# Altium project TicketBot.PrjPcb
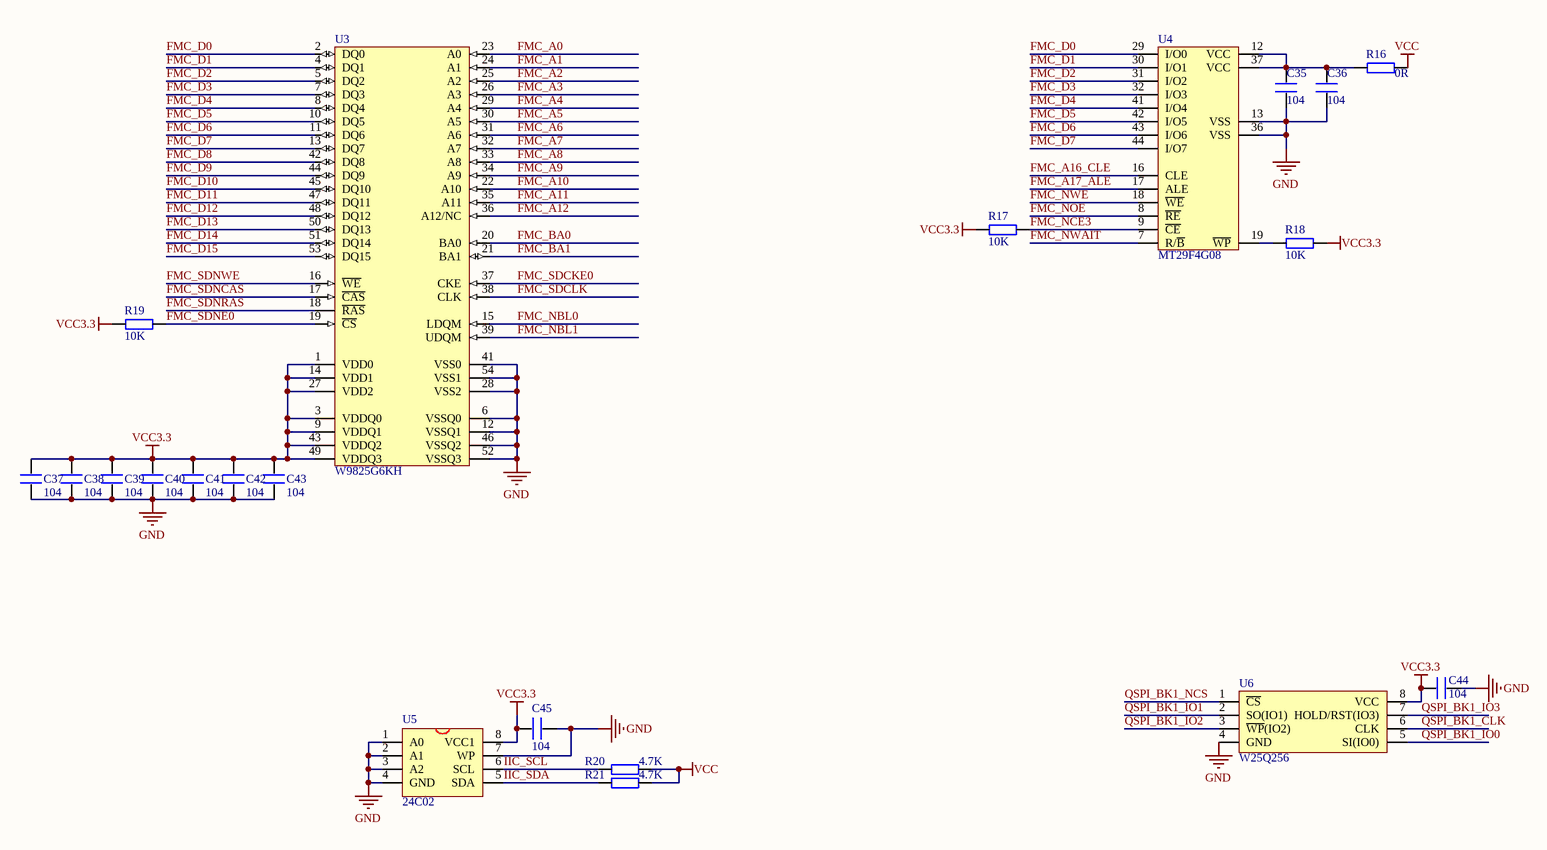
[diagram p0: mem.SchDoc]
2 sheets, 65 parts. Net scope: global (net labels, ports and power ports of the same name join across sheets).
Board files: corePCB1.PcbDoc, corePCB1nohighfreq.PcbDoc, corePCB.PcbDoc
Sheets:
  mem.SchDoc
  stm.SchDoc

## Sheet mem.SchDoc
size Tabloid

### Parts
C35  104  [0805]
C36  104  [0805]
C37  104  [0805]
C38  104  [0805]
C39  104  [0805]
C40  104  [0805]
C41  104  [0805]
C42  104  [0805]
C43  104  [0805]
C44  104  [0805]
C45  104  [0805]
R16  0R  [0805]
R17  10K  [0805]
R18  10K  [0805]
R19  10K  [0805]
R20  4.7K  [0805]
R21  4.7K  [0805]
U3  W9825G6KH  [TSOP54]
U4  MT29F4G08  [TSOP48]
U5  24C02  [SOP-8]
U6  W25Q256  [WSON8]

### Nets
GND: C35.1 C36.1 C37.1 C38.1 C39.1 C40.1 C41.1 C42.1 C43.1 C44.2 C45.2 U3.6(VSSQ0) U3.12(VSSQ1) U3.28(VSS2) U3.41(VSS0) U3.46(VSSQ2) U3.52(VSSQ3) U3.54(VSS1) U4.13(VSS) U4.36(VSS) U5.1(A0) U5.2(A1) U5.3(A2) U5.4(GND) U5.7(WP) U6.4(GND)
VCC: R16.2 R20.2 R21.2
VCC3.3: C37.2 C38.2 C39.2 C40.2 C41.2 C42.2 C43.2 C44.1 C45.1 R17.1 R18.2 R19.1 U3.1(VDD0) U3.3(VDDQ0) U3.9(VDDQ1) U3.14(VDD1) U3.27(VDD2) U3.43(VDDQ2) U3.49(VDDQ3) U5.8(VCC1) U6.8(VCC)
FMC_A0: U3.23(A0)
FMC_A1: U3.24(A1)
FMC_A2: U3.25(A2)
FMC_A3: U3.26(A3)
FMC_A4: U3.29(A4)
FMC_A5: U3.30(A5)
FMC_A6: U3.31(A6)
FMC_A7: U3.32(A7)
FMC_A8: U3.33(A8)
FMC_A9: U3.34(A9)
FMC_A10: U3.22(A10)
FMC_A11: U3.35(A11)
FMC_A12: U3.36(A12/NC)
FMC_A16_CLE: U4.16(CLE)
FMC_A17_ALE: U4.17(ALE)
FMC_BA0: U3.20(BA0)
FMC_BA1: U3.21(BA1)
FMC_D0: U3.2(DQ0) U4.29(I/O0)
FMC_D1: U3.4(DQ1) U4.30(I/O1)
FMC_D2: U3.5(DQ2) U4.31(I/O2)
FMC_D3: U3.7(DQ3) U4.32(I/O3)
FMC_D4: U3.8(DQ4) U4.41(I/O4)
FMC_D5: U3.10(DQ5) U4.42(I/O5)
FMC_D6: U3.11(DQ6) U4.43(I/O6)
FMC_D7: U3.13(DQ7) U4.44(I/O7)
FMC_D8: U3.42(DQ8)
FMC_D9: U3.44(DQ9)
FMC_D10: U3.45(DQ10)
FMC_D11: U3.47(DQ11)
FMC_D12: U3.48(DQ12)
FMC_D13: U3.50(DQ13)
FMC_D14: U3.51(DQ14)
FMC_D15: U3.53(DQ15)
FMC_NBL0: U3.15(LDQM)
FMC_NBL1: U3.39(UDQM)
FMC_NCE3: R17.2 U4.9(~{CE})
FMC_NOE: U4.8(~{RE})
FMC_NWAIT: U4.7(R/~{B})
FMC_NWE: U4.18(~{WE})
FMC_SDCKE0: U3.37(CKE)
FMC_SDCLK: U3.38(CLK)
FMC_SDNCAS: U3.17(~{CAS})
FMC_SDNE0: R19.2 U3.19(~{CS})
FMC_SDNRAS: U3.18(~{RAS})
FMC_SDNWE: U3.16(~{WE})
IIC_SCL: R20.1 U5.6(SCL)
IIC_SDA: R21.1 U5.5(SDA)
QSPI_BK1_CLK: U6.6(CLK)  [project net PB2]
QSPI_BK1_IO0: U6.5(SI(IO0))  [project net PF8]
QSPI_BK1_IO1: U6.2(SO(IO1))  [project net PF9]
QSPI_BK1_IO2: U6.3(~{WP}(IO2))  [project net PF7]
QSPI_BK1_IO3: U6.7(HOLD/RST(IO3))  [project net PF6]
QSPI_BK1_NCS: U6.1(~{CS})  [project net PB6]
NetC35_2: C35.2 C36.2 R16.1 U4.12(VCC) U4.37(VCC)
NetR18_1: R18.1 U4.19(~{WP})

### Library data of the parts
C35-C45 = C
R16-R21 = R
U3 = IS42S16160B: 32MB SDRAM
U4 = K9F2G08U0C: 256MB NAND FLASH
U5 = 24C256: EEPROM
U6 = W25Q128

## Sheet stm.SchDoc
size Tabloid
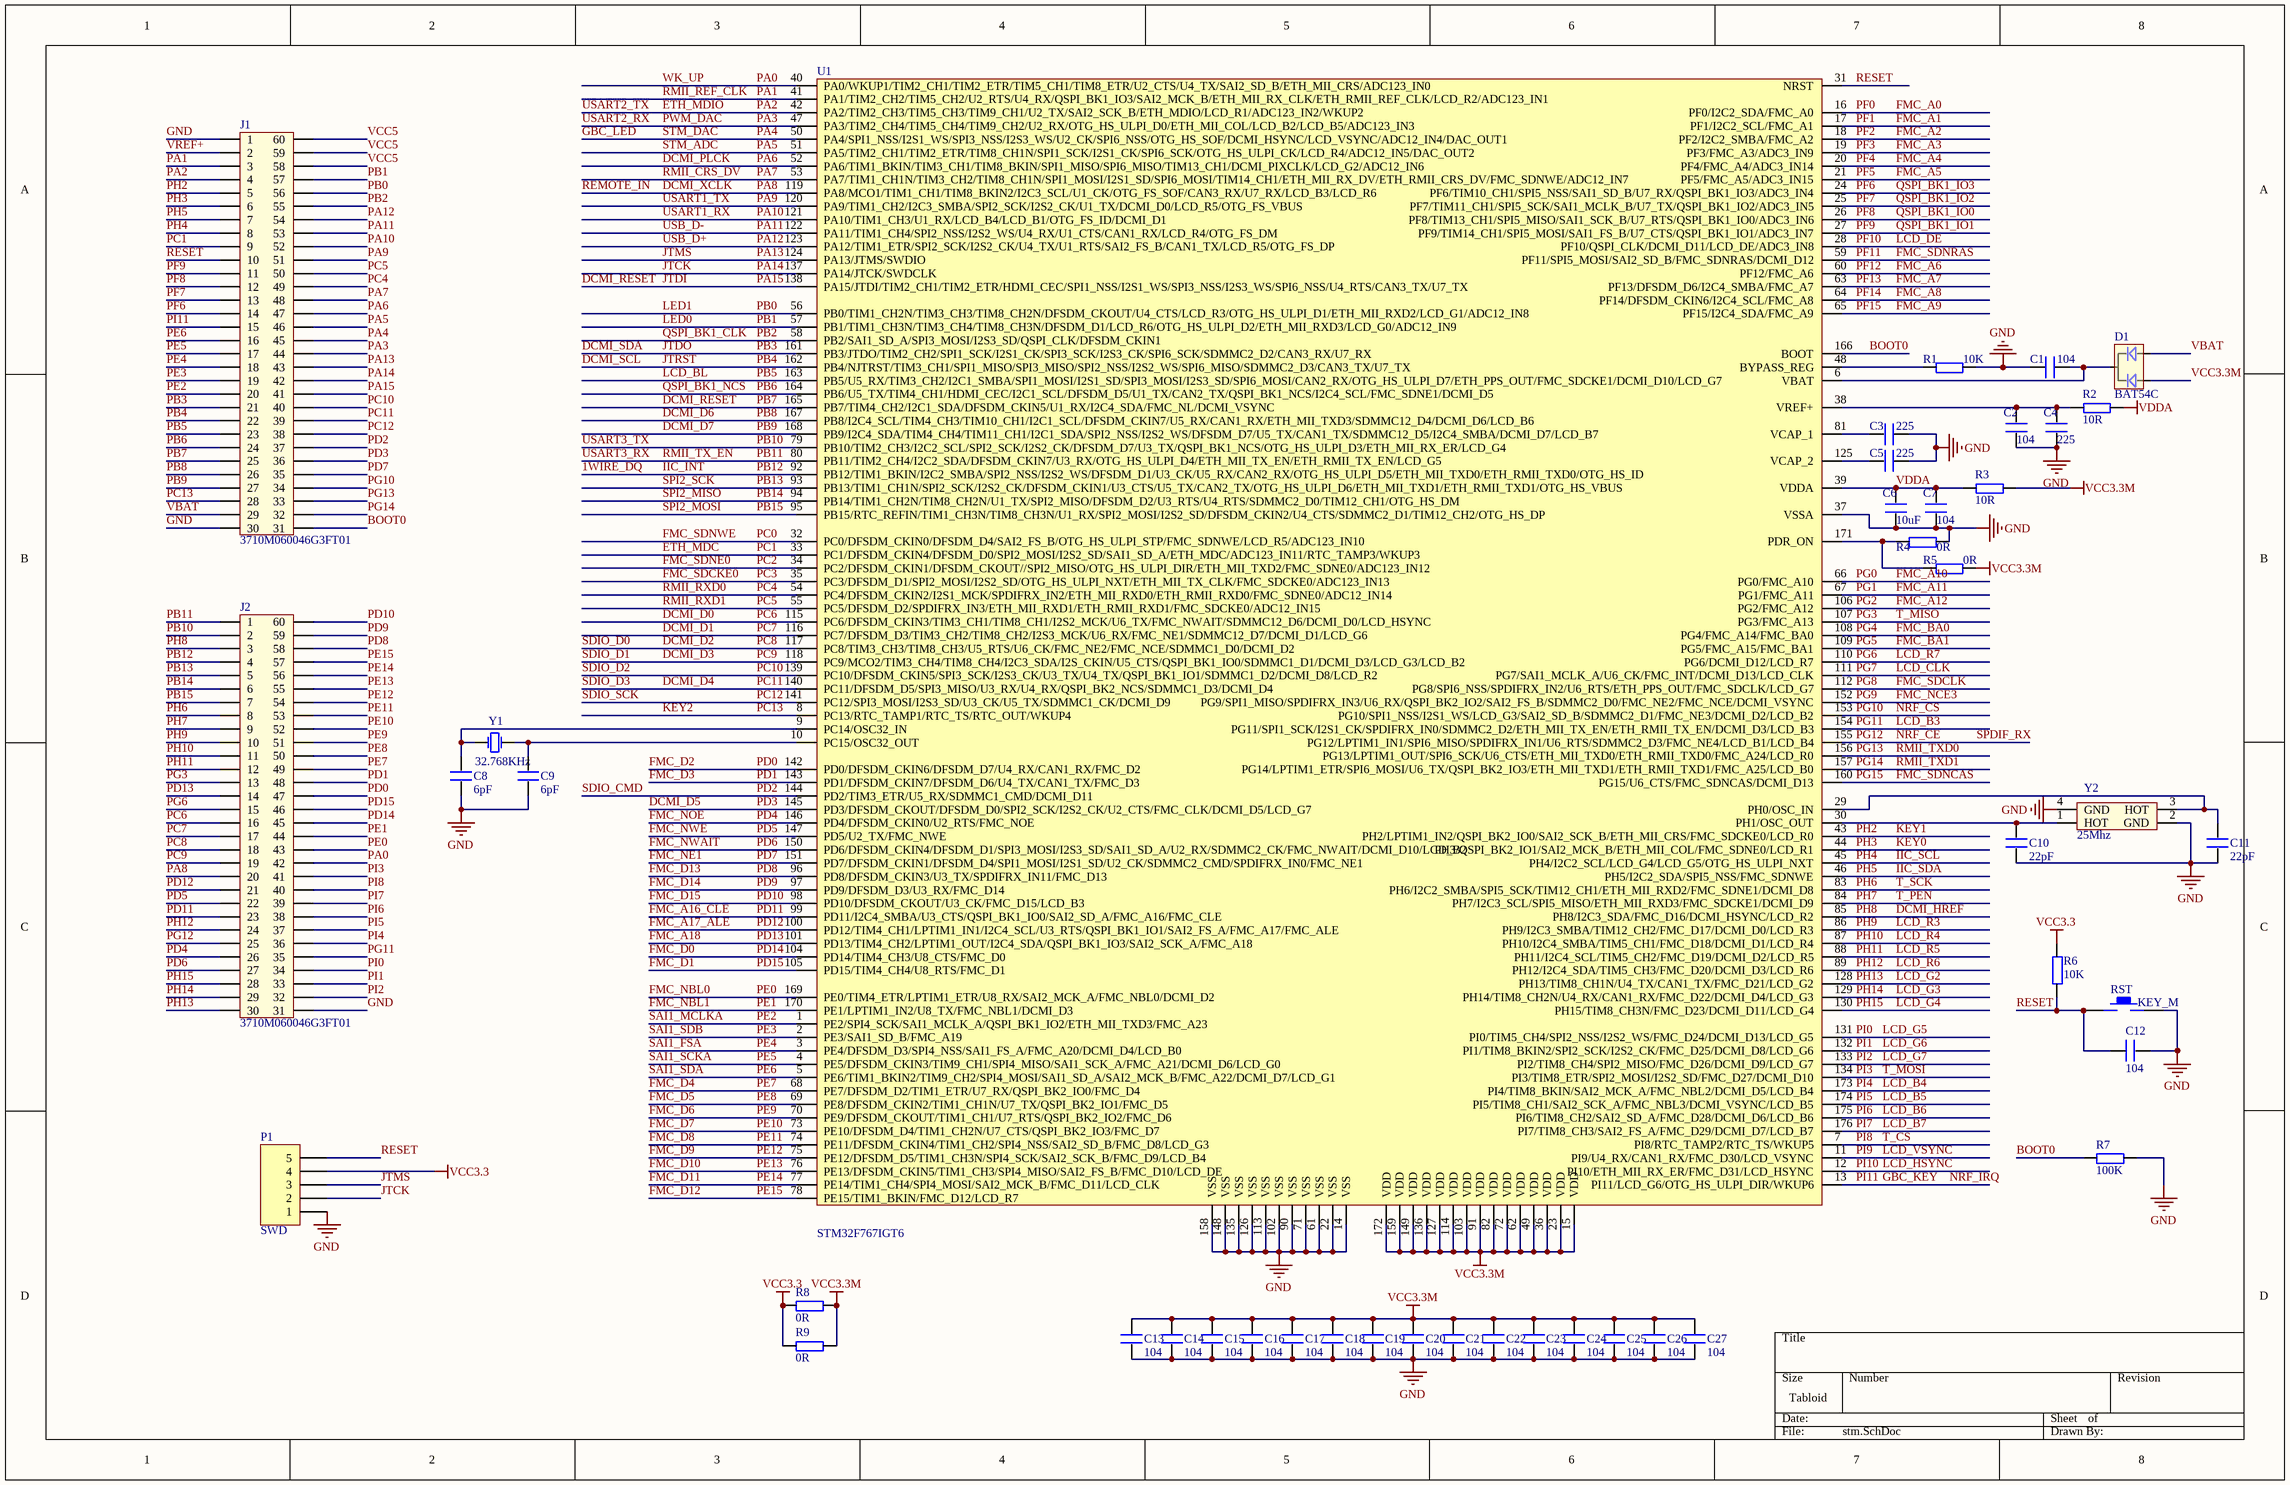
[diagram p1: stm.SchDoc]

### Parts
C1  104  [0805]
C2  104  [0805]
C3  225  [0805]
C4  225  [0805]
C5  225  [0805]
C6  10uF  [0805]
C7  104  [0805]
C8  6pF  [0805]
C9  6pF  [0805]
C10  22pF  [0805]
C11  22pF  [0805]
C12  104  [0805]
C13  104  [0805]
C14  104  [0805]
C15  104  [0805]
C16  104  [0805]
C17  104  [0805]
C18  104  [0805]
C19  104  [0805]
C20  104  [0805]
C21  104  [0805]
C22  104  [0805]
C23  104  [0805]
C24  104  [0805]
C25  104  [0805]
C26  104  [0805]
C27  104  [0805]
D1  BAT54C  [SOT-23]
J1  3710M060046G3FT01  [3710F060046G3FT01]
J2  3710M060046G3FT01  [3710F060046G3FT01]
P1  SWD  [HDR1X5]
R1  10K  [0805]
R2  10R  [0805]
R3  10R  [0805]
R4  0R  [0805]
R5  0R  [0805]
R6  10K  [0805]
R7  100K  [0805]
R8  0R  [0805]
R9  0R  [0805]
RST  KEY_M  [KEY_SOP3625]
U1  STM32F767IGT6  [LQFP176]
Y1  32.768KHz  [XTAL3215]
Y2  25Mhz  [XTAL3225]

### Nets
GND: C1.2 C2.1 C3.2 C4.1 C5.2 C6.1 C7.1 C8.1 C9.1 C10.1 C11.1 C12.2 C13.1 C14.1 C15.1 C16.1 C17.1 C18.1 C19.1 C20.1 C21.1 C22.1 C23.1 C24.1 C25.1 C26.1 C27.1 J1.1 J1.30 J2.31 P1.1 R1.2 R4.2 R7.2 RST.2 U1.14(VSS) U1.22(VSS) U1.37(VSSA) U1.61(VSS) U1.71(VSS) U1.90(VSS) U1.102(VSS) U1.113(VSS) U1.126(VSS) U1.135(VSS) U1.148(VSS) U1.158(VSS) Y2.2(GND) Y2.4(GND)
VCC3.3: P1.4 R6.2 R8.1 R9.1
VCC3.3M: C13.2 C14.2 C15.2 C16.2 C17.2 C18.2 C19.2 C20.2 C21.2 C22.2 C23.2 C24.2 C25.2 C26.2 C27.2 D1.1 R3.2 R5.2 R8.2 R9.2 U1.15(VDD) U1.23(VDD) U1.36(VDD) U1.49(VDD) U1.62(VDD) U1.72(VDD) U1.82(VDD) U1.91(VDD) U1.103(VDD) U1.114(VDD) U1.127(VDD) U1.136(VDD) U1.149(VDD) U1.159(VDD) U1.172(VDD)
VDDA: C6.2 C7.2 R2.2 R3.1 U1.39(VDDA)
1WIRE_DQ: J2.4 U1.92(PB12/TIM1_BKIN/I2C2_SMBA/SPI2_NSS/I2S2_WS/DFSDM_D1/U3_CK/U5_RX/CAN2_RX/OTG_HS_ULPI_D5/ETH_MII_TXD0/ETH_RMII_TXD0/OTG_HS_ID)  [also labelled IIC_INT, PB12]
BOOT0: J1.31 R7.1 U1.166(BOOT)
DCMI_D0: J2.16 U1.115(PC6/DFSDM_CKIN3/TIM3_CH1/TIM8_CH1/I2S2_MCK/U6_TX/FMC_NWAIT/SDMMC12_D6/DCMI_D0/LCD_HSYNC)  [also labelled PC6]
DCMI_D1: J2.17 U1.116(PC7/DFSDM_D3/TIM3_CH2/TIM8_CH2/I2S3_MCK/U6_RX/FMC_NE1/SDMMC12_D7/DCMI_D1/LCD_G6)  [also labelled PC7]
DCMI_D2: J2.18 U1.117(PC8/TIM3_CH3/TIM8_CH3/U5_RTS/U6_CK/FMC_NE2/FMC_NCE/SDMMC1_D0/DCMI_D2)  [also labelled PC8, SDIO_D0]
DCMI_D3: J2.19 U1.118(PC9/MCO2/TIM3_CH4/TIM8_CH4/I2C3_SDA/I2S_CKIN/U5_CTS/QSPI_BK1_IO0/SDMMC1_D1/DCMI_D3/LCD_G3/LCD_B2)  [also labelled PC9, SDIO_D1]
DCMI_D4: J1.39 U1.140(PC11/DFSDM_D5/SPI3_MISO/U3_RX/U4_RX/QSPI_BK2_NCS/SDMMC1_D3/DCMI_D4)  [also labelled PC11, SDIO_D3]
DCMI_D5: J1.36 U1.145(PD3/DFSDM_CKOUT/DFSDM_D0/SPI2_SCK/I2S2_CK/U2_CTS/FMC_CLK/DCMI_D5/LCD_G7)  [also labelled PD3]
DCMI_D6: J1.26 U1.167(PB8/I2C4_SCL/TIM4_CH3/TIM10_CH1/I2C1_SCL/DFSDM_CKIN7/U5_RX/CAN1_RX/ETH_MII_TXD3/SDMMC12_D4/DCMI_D6/LCD_B6)  [also labelled PB8]
DCMI_D7: J1.27 U1.168(PB9/I2C4_SDA/TIM4_CH4/TIM11_CH1/I2C1_SDA/SPI2_NSS/I2S2_WS/DFSDM_D7/U5_TX/CAN1_TX/SDMMC12_D5/I2C4_SMBA/DCMI_D7/LCD_B7)  [also labelled PB9]
DCMI_HREF: J2.3 U1.85(PH8/I2C3_SDA/FMC_D16/DCMI_HSYNC/LCD_R2)  [also labelled PH8]
DCMI_PLCK: J1.47 U1.52(PA6/TIM1_BKIN/TIM3_CH1/TIM8_BKIN/SPI1_MISO/SPI6_MISO/TIM13_CH1/DCMI_PIXCLK/LCD_G2/ADC12_IN6)  [also labelled PA6]
DCMI_RESET: J1.25 J1.41 U1.138(PA15/JTDI/TIM2_CH1/TIM2_ETR/HDMI_CEC/SPI1_NSS/I2S1_WS/SPI3_NSS/I2S3_WS/SPI6_NSS/U4_RTS/CAN3_TX/U7_TX) U1.165(PB7/TIM4_CH2/I2C1_SDA/DFSDM_CKIN5/U1_RX/I2C4_SDA/FMC_NL/DCMI_VSYNC)  [also labelled JTDI, PA15, PB7]
DCMI_SCL: J1.22 U1.162(PB4/NJTRST/TIM3_CH1/SPI1_MISO/SPI3_MISO/SPI2_NSS/I2S2_WS/SPI6_MISO/SDMMC2_D3/CAN3_TX/U7_TX)  [also labelled JTRST, PB4]
DCMI_SDA: J1.21 U1.161(PB3/JTDO/TIM2_CH2/SPI1_SCK/I2S1_CK/SPI3_SCK/I2S3_CK/SPI6_SCK/SDMMC2_D2/CAN3_RX/U7_RX)  [also labelled JTDO, PB3]
DCMI_XCLK: J2.20 U1.119(PA8/MCO1/TIM1_CH1/TIM8_BKIN2/I2C3_SCL/U1_CK/OTG_FS_SOF/CAN3_RX/U7_RX/LCD_B3/LCD_R6)  [also labelled PA8, REMOTE_IN]
ETH_MDC: J1.9 U1.33(PC1/DFSDM_CKIN4/DFSDM_D0/SPI2_MOSI/I2S2_SD/SAI1_SD_A/ETH_MDC/ADC123_IN11/RTC_TAMP3/WKUP3)  [also labelled PC1]
ETH_MDIO: J1.4 U1.42(PA2/TIM2_CH3/TIM5_CH3/TIM9_CH1/U2_TX/SAI2_SCK_B/ETH_MDIO/LCD_R1/ADC123_IN2/WKUP2)  [also labelled PA2, USART2_TX]
FMC_A0: U1.16(PF0/I2C2_SDA/FMC_A0)  [also labelled PF0]
FMC_A1: U1.17(PF1/I2C2_SCL/FMC_A1)  [also labelled PF1]
FMC_A2: U1.18(PF2/I2C2_SMBA/FMC_A2)  [also labelled PF2]
FMC_A3: U1.19(PF3/FMC_A3/ADC3_IN9)  [also labelled PF3]
FMC_A4: U1.20(PF4/FMC_A4/ADC3_IN14)  [also labelled PF4]
FMC_A5: U1.21(PF5/FMC_A5/ADC3_IN15)  [also labelled PF5]
FMC_A6: U1.60(PF12/FMC_A6)  [also labelled PF12]
FMC_A7: U1.63(PF13/DFSDM_D6/I2C4_SMBA/FMC_A7)  [also labelled PF13]
FMC_A8: U1.64(PF14/DFSDM_CKIN6/I2C4_SCL/FMC_A8)  [also labelled PF14]
FMC_A9: U1.65(PF15/I2C4_SDA/FMC_A9)  [also labelled PF15]
FMC_A10: U1.66(PG0/FMC_A10)  [also labelled PG0]
FMC_A11: U1.67(PG1/FMC_A11)  [also labelled PG1]
FMC_A12: U1.106(PG2/FMC_A12)  [also labelled PG2]
FMC_A16_CLE: J2.23 U1.99(PD11/I2C4_SMBA/U3_CTS/QSPI_BK1_IO0/SAI2_SD_A/FMC_A16/FMC_CLE)  [also labelled PD11]
FMC_A17_ALE: J2.21 U1.100(PD12/TIM4_CH1/LPTIM1_IN1/I2C4_SCL/U3_RTS/QSPI_BK1_IO1/SAI2_FS_A/FMC_A17/FMC_ALE)  [also labelled PD12]
FMC_A18: J2.14 U1.101(PD13/TIM4_CH2/LPTIM1_OUT/I2C4_SDA/QSPI_BK1_IO3/SAI2_SCK_A/FMC_A18)  [also labelled PD13]
FMC_BA0: U1.108(PG4/FMC_A14/FMC_BA0)  [also labelled PG4]
FMC_BA1: U1.109(PG5/FMC_A15/FMC_BA1)  [also labelled PG5]
FMC_D0: J2.45 U1.104(PD14/TIM4_CH3/U8_CTS/FMC_D0)  [also labelled PD14]
FMC_D1: J2.46 U1.105(PD15/TIM4_CH4/U8_RTS/FMC_D1)  [also labelled PD15]
FMC_D2: J2.47 U1.142(PD0/DFSDM_CKIN6/DFSDM_D7/U4_RX/CAN1_RX/FMC_D2)  [also labelled PD0]
FMC_D3: J2.48 U1.143(PD1/DFSDM_CKIN7/DFSDM_D6/U4_TX/CAN1_TX/FMC_D3)  [also labelled PD1]
FMC_D4: J2.49 U1.68(PE7/DFSDM_D2/TIM1_ETR/U7_RX/QSPI_BK2_IO0/FMC_D4)  [also labelled PE7]
FMC_D5: J2.50 U1.69(PE8/DFSDM_CKIN2/TIM1_CH1N/U7_TX/QSPI_BK2_IO1/FMC_D5)  [also labelled PE8]
FMC_D6: J2.51 U1.70(PE9/DFSDM_CKOUT/TIM1_CH1/U7_RTS/QSPI_BK2_IO2/FMC_D6)  [also labelled PE9]
FMC_D7: J2.52 U1.73(PE10/DFSDM_D4/TIM1_CH2N/U7_CTS/QSPI_BK2_IO3/FMC_D7)  [also labelled PE10]
FMC_D8: J2.53 U1.74(PE11/DFSDM_CKIN4/TIM1_CH2/SPI4_NSS/SAI2_SD_B/FMC_D8/LCD_G3)  [also labelled PE11]
FMC_D9: J2.54 U1.75(PE12/DFSDM_D5/TIM1_CH3N/SPI4_SCK/SAI2_SCK_B/FMC_D9/LCD_B4)  [also labelled PE12]
FMC_D10: J2.55 U1.76(PE13/DFSDM_CKIN5/TIM1_CH3/SPI4_MISO/SAI2_FS_B/FMC_D10/LCD_DE)  [also labelled PE13]
FMC_D11: J2.56 U1.77(PE14/TIM1_CH4/SPI4_MOSI/SAI2_MCK_B/FMC_D11/LCD_CLK)  [also labelled PE14]
FMC_D12: J2.57 U1.78(PE15/TIM1_BKIN/FMC_D12/LCD_R7)  [also labelled PE15]
FMC_D13: J2.58 U1.96(PD8/DFSDM_CKIN3/U3_TX/SPDIFRX_IN11/FMC_D13)  [also labelled PD8]
FMC_D14: J2.59 U1.97(PD9/DFSDM_D3/U3_RX/FMC_D14)  [also labelled PD9]
FMC_D15: J2.60 U1.98(PD10/DFSDM_CKOUT/U3_CK/FMC_D15/LCD_B3)  [also labelled PD10]
FMC_NBL0: J2.43 U1.169(PE0/TIM4_ETR/LPTIM1_ETR/U8_RX/SAI2_MCK_A/FMC_NBL0/DCMI_D2)  [also labelled PE0]
FMC_NBL1: J2.44 U1.170(PE1/LPTIM1_IN2/U8_TX/FMC_NBL1/DCMI_D3)  [also labelled PE1]
FMC_NCE3: U1.152(PG9/SPI1_MISO/SPDIFRX_IN3/U6_RX/QSPI_BK2_IO2/SAI2_FS_B/SDMMC2_D0/FMC_NE2/FMC_NCE/DCMI_VSYNC)  [also labelled PG9]
FMC_NE1: J1.35 U1.151(PD7/DFSDM_CKIN1/DFSDM_D4/SPI1_MOSI/I2S1_SD/U2_CK/SDMMC2_CMD/SPDIFRX_IN0/FMC_NE1)  [also labelled PD7]
FMC_NOE: J2.26 U1.146(PD4/DFSDM_CKIN0/U2_RTS/FMC_NOE)  [also labelled PD4]
FMC_NWAIT: J2.27 U1.150(PD6/DFSDM_CKIN4/DFSDM_D1/SPI3_MOSI/I2S3_SD/SAI1_SD_A/U2_RX/SDMMC2_CK/FMC_NWAIT/DCMI_D10/LCD_B2)  [also labelled PD6]
FMC_NWE: J2.22 U1.147(PD5/U2_TX/FMC_NWE)  [also labelled PD5]
FMC_SDCKE0: U1.35(PC3/DFSDM_D1/SPI2_MOSI/I2S2_SD/OTG_HS_ULPI_NXT/ETH_MII_TX_CLK/FMC_SDCKE0/ADC123_IN13)  [also labelled PC3]
FMC_SDCLK: U1.112(PG8/SPI6_NSS/SPDIFRX_IN2/U6_RTS/ETH_PPS_OUT/FMC_SDCLK/LCD_G7)  [also labelled PG8]
FMC_SDNCAS: U1.160(PG15/U6_CTS/FMC_SDNCAS/DCMI_D13)  [also labelled PG15]
FMC_SDNE0: U1.34(PC2/DFSDM_CKIN1/DFSDM_CKOUT//SPI2_MISO/OTG_HS_ULPI_DIR/ETH_MII_TXD2/FMC_SDNE0/ADC123_IN12)  [also labelled PC2]
FMC_SDNRAS: U1.59(PF11/SPI5_MOSI/SAI2_SD_B/FMC_SDNRAS/DCMI_D12)  [also labelled PF11]
FMC_SDNWE: U1.32(PC0/DFSDM_CKIN0/DFSDM_D4/SAI2_FS_B/OTG_HS_ULPI_STP/FMC_SDNWE/LCD_R5/ADC123_IN10)  [also labelled PC0]
GBC_KEY: J1.15 U1.13(PI11/LCD_G6/OTG_HS_ULPI_DIR/WKUP6)  [also labelled NRF_IRQ, PI11]
GBC_LED: J1.45 U1.50(PA4/SPI1_NSS/I2S1_WS/SPI3_NSS/I2S3_WS/U2_CK/SPI6_NSS/OTG_HS_SOF/DCMI_HSYNC/LCD_VSYNC/ADC12_IN4/DAC_OUT1)  [also labelled PA4, STM_DAC]
IIC_SCL: J1.8 U1.45(PH4/I2C2_SCL/LCD_G4/LCD_G5/OTG_HS_ULPI_NXT)  [also labelled PH4]
IIC_SDA: J1.7 U1.46(PH5/I2C2_SDA/SPI5_NSS/FMC_SDNWE)  [also labelled PH5]
JTCK: J1.42 P1.2 U1.137(PA14/JTCK/SWDCLK)  [also labelled PA14]
JTMS: J1.43 P1.3 U1.124(PA13/JTMS/SWDIO)  [also labelled PA13]
KEY0: J1.6 U1.44(PH3/QSPI_BK2_IO1/SAI2_MCK_B/ETH_MII_COL/FMC_SDNE0/LCD_R1)  [also labelled PH3]
KEY1: J1.5 U1.43(PH2/LPTIM1_IN2/QSPI_BK2_IO0/SAI2_SCK_B/ETH_MII_CRS/FMC_SDCKE0/LCD_R0)  [also labelled PH2]
KEY2: J1.28 U1.8(PC13/RTC_TAMP1/RTC_TS/RTC_OUT/WKUP4)  [also labelled PC13]
LCD_B3: J2.35 U1.154(PG11/SPI1_SCK/I2S1_CK/SPDIFRX_IN0/SDMMC2_D2/ETH_MII_TX_EN/ETH_RMII_TX_EN/DCMI_D3/LCD_B3)  [also labelled PG11]
LCD_B4: J2.36 U1.173(PI4/TIM8_BKIN/SAI2_MCK_A/FMC_NBL2/DCMI_D5/LCD_B4)  [also labelled PI4]
LCD_B5: J2.37 U1.174(PI5/TIM8_CH1/SAI2_SCK_A/FMC_NBL3/DCMI_VSYNC/LCD_B5)  [also labelled PI5]
LCD_B6: J2.38 U1.175(PI6/TIM8_CH2/SAI2_SD_A/FMC_D28/DCMI_D6/LCD_B6)  [also labelled PI6]
LCD_B7: J2.39 U1.176(PI7/TIM8_CH3/SAI2_FS_A/FMC_D29/DCMI_D7/LCD_B7)  [also labelled PI7]
LCD_BL: J1.23 U1.163(PB5/U5_RX/TIM3_CH2/I2C1_SMBA/SPI1_MOSI/I2S1_SD/SPI3_MOSI/I2S3_SD/SPI6_MOSI/CAN2_RX/OTG_HS_ULPI_D7/ETH_PPS_OUT/FMC_SDCKE1/DCMI_D10/LCD_G7)  [also labelled PB5]
LCD_CLK: U1.111(PG7/SAI1_MCLK_A/U6_CK/FMC_INT/DCMI_D13/LCD_CLK)  [also labelled PG7]
LCD_DE: U1.28(PF10/QSPI_CLK/DCMI_D11/LCD_DE/ADC3_IN8)  [also labelled PF10]
LCD_G2: J2.30 U1.128(PH13/TIM8_CH1N/U4_TX/CAN1_TX/FMC_D21/LCD_G2)  [also labelled PH13]
LCD_G3: J2.29 U1.129(PH14/TIM8_CH2N/U4_RX/CAN1_RX/FMC_D22/DCMI_D4/LCD_G3)  [also labelled PH14]
LCD_G4: J2.28 U1.130(PH15/TIM8_CH3N/FMC_D23/DCMI_D11/LCD_G4)  [also labelled PH15]
LCD_G5: J2.34 U1.131(PI0/TIM5_CH4/SPI2_NSS/I2S2_WS/FMC_D24/DCMI_D13/LCD_G5)  [also labelled PI0]
LCD_G6: J2.33 U1.132(PI1/TIM8_BKIN2/SPI2_SCK/I2S2_CK/FMC_D25/DCMI_D8/LCD_G6)  [also labelled PI1]
LCD_G7: J2.32 U1.133(PI2/TIM8_CH4/SPI2_MISO/FMC_D26/DCMI_D9/LCD_G7)  [also labelled PI2]
LCD_HSYNC: U1.12(PI10/ETH_MII_RX_ER/FMC_D31/LCD_HSYNC)  [also labelled PI10]
LCD_R3: J2.10 U1.86(PH9/I2C3_SMBA/TIM12_CH2/FMC_D17/DCMI_D0/LCD_R3)  [also labelled PH9]
LCD_R4: J2.11 U1.87(PH10/I2C4_SMBA/TIM5_CH1/FMC_D18/DCMI_D1/LCD_R4)  [also labelled PH10]
LCD_R5: J2.12 U1.88(PH11/I2C4_SCL/TIM5_CH2/FMC_D19/DCMI_D2/LCD_R5)  [also labelled PH11]
LCD_R6: J2.24 U1.89(PH12/I2C4_SDA/TIM5_CH3/FMC_D20/DCMI_D3/LCD_R6)  [also labelled PH12]
LCD_R7: J2.15 U1.110(PG6/DCMI_D12/LCD_R7)  [also labelled PG6]
LCD_VSYNC: U1.11(PI9/U4_RX/CAN1_RX/FMC_D30/LCD_VSYNC)  [also labelled PI9]
LED0: J1.57 U1.57(PB1/TIM1_CH3N/TIM3_CH4/TIM8_CH3N/DFSDM_D1/LCD_R6/OTG_HS_ULPI_D2/ETH_MII_RXD3/LCD_G0/ADC12_IN9)  [also labelled PB1]
LED1: J1.56 U1.56(PB0/TIM1_CH2N/TIM3_CH3/TIM8_CH2N/DFSDM_CKOUT/U4_CTS/LCD_R3/OTG_HS_ULPI_D1/ETH_MII_RXD2/LCD_G1/ADC12_IN8)  [also labelled PB0]
NRF_CE: J2.25 U1.155(PG12/LPTIM1_IN1/SPI6_MISO/SPDIFRX_IN1/U6_RTS/SDMMC2_D3/FMC_NE4/LCD_B1/LCD_B4)  [also labelled PG12, SPDIF_RX]
NRF_CS: J1.34 U1.153(PG10/SPI1_NSS/I2S1_WS/LCD_G3/SAI2_SD_B/SDMMC2_D1/FMC_NE3/DCMI_D2/LCD_B2)  [also labelled PG10]
PA0: J2.42 U1.40(PA0/WKUP1/TIM2_CH1/TIM2_ETR/TIM5_CH1/TIM8_ETR/U2_CTS/U4_TX/SAI2_SD_B/ETH_MII_CRS/ADC123_IN0)  [also labelled WK_UP]
PA1: J1.3 U1.41(PA1/TIM2_CH2/TIM5_CH2/U2_RTS/U4_RX/QSPI_BK1_IO3/SAI2_MCK_B/ETH_MII_RX_CLK/ETH_RMII_REF_CLK/LCD_R2/ADC123_IN1)  [also labelled RMII_REF_CLK]
PA3: J1.44 U1.47(PA3/TIM2_CH4/TIM5_CH4/TIM9_CH2/U2_RX/OTG_HS_ULPI_D0/ETH_MII_COL/LCD_B2/LCD_B5/ADC123_IN3)  [also labelled PWM_DAC, USART2_RX]
PA5: J1.46 U1.51(PA5/TIM2_CH1/TIM2_ETR/TIM8_CH1N/SPI1_SCK/I2S1_CK/SPI6_SCK/OTG_HS_ULPI_CK/LCD_R4/ADC12_IN5/DAC_OUT2)  [also labelled STM_ADC]
PA7: J1.48 U1.53(PA7/TIM1_CH1N/TIM3_CH2/TIM8_CH1N/SPI1_MOSI/I2S1_SD/SPI6_MOSI/TIM14_CH1/ETH_MII_RX_DV/ETH_RMII_CRS_DV/FMC_SDNWE/ADC12_IN7)  [also labelled RMII_CRS_DV]
PA9: J1.51 U1.120(PA9/TIM1_CH2/I2C3_SMBA/SPI2_SCK/I2S2_CK/U1_TX/DCMI_D0/LCD_R5/OTG_FS_VBUS)  [also labelled USART1_TX]
PA10: J1.52 U1.121(PA10/TIM1_CH3/U1_RX/LCD_B4/LCD_B1/OTG_FS_ID/DCMI_D1)  [also labelled USART1_RX]
PA11: J1.53 U1.122(PA11/TIM1_CH4/SPI2_NSS/I2S2_WS/U4_RX/U1_CTS/CAN1_RX/LCD_R4/OTG_FS_DM)  [also labelled USB_D-]
PA12: J1.54 U1.123(PA12/TIM1_ETR/SPI2_SCK/I2S2_CK/U4_TX/U1_RTS/SAI2_FS_B/CAN1_TX/LCD_R5/OTG_FS_DP)  [also labelled USB_D+]
PB2: J1.55 U1.58(PB2/SAI1_SD_A/SPI3_MOSI/I2S3_SD/QSPI_CLK/DFSDM_CKIN1)  [also labelled QSPI_BK1_CLK]
PB6: J1.24 U1.164(PB6/U5_TX/TIM4_CH1/HDMI_CEC/I2C1_SCL/DFSDM_D5/U1_TX/CAN2_TX/QSPI_BK1_NCS/I2C4_SCL/FMC_SDNE1/DCMI_D5)  [also labelled QSPI_BK1_NCS]
PB10: J2.2 U1.79(PB10/TIM2_CH3/I2C2_SCL/SPI2_SCK/I2S2_CK/DFSDM_D7/U3_TX/QSPI_BK1_NCS/OTG_HS_ULPI_D3/ETH_MII_RX_ER/LCD_G4)  [also labelled USART3_TX]
PB11: J2.1 U1.80(PB11/TIM2_CH4/I2C2_SDA/DFSDM_CKIN7/U3_RX/OTG_HS_ULPI_D4/ETH_MII_TX_EN/ETH_RMII_TX_EN/LCD_G5)  [also labelled RMII_TX_EN, USART3_RX]
PB13: J2.5 U1.93(PB13/TIM1_CH1N/SPI2_SCK/I2S2_CK/DFSDM_CKIN1/U3_CTS/U5_TX/CAN2_TX/OTG_HS_ULPI_D6/ETH_MII_TXD1/ETH_RMII_TXD1/OTG_HS_VBUS)  [also labelled SPI2_SCK]
PB14: J2.6 U1.94(PB14/TIM1_CH2N/TIM8_CH2N/U1_TX/SPI2_MISO/DFSDM_D2/U3_RTS/U4_RTS/SDMMC2_D0/TIM12_CH1/OTG_HS_DM)  [also labelled SPI2_MISO]
PB15: J2.7 U1.95(PB15/RTC_REFIN/TIM1_CH3N/TIM8_CH3N/U1_RX/SPI2_MOSI/I2S2_SD/DFSDM_CKIN2/U4_CTS/SDMMC2_D1/TIM12_CH2/OTG_HS_DP)  [also labelled SPI2_MOSI]
PC4: J1.49 U1.54(PC4/DFSDM_CKIN2/I2S1_MCK/SPDIFRX_IN2/ETH_MII_RXD0/ETH_RMII_RXD0/FMC_SDNE0/ADC12_IN14)  [also labelled RMII_RXD0]
PC5: J1.50 U1.55(PC5/DFSDM_D2/SPDIFRX_IN3/ETH_MII_RXD1/ETH_RMII_RXD1/FMC_SDCKE0/ADC12_IN15)  [also labelled RMII_RXD1]
PC10: J1.40 U1.139(PC10/DFSDM_CKIN5/SPI3_SCK/I2S3_CK/U3_TX/U4_TX/QSPI_BK1_IO1/SDMMC1_D2/DCMI_D8/LCD_R2)  [also labelled SDIO_D2]
PC12: J1.38 U1.141(PC12/SPI3_MOSI/I2S3_SD/U3_CK/U5_TX/SDMMC1_CK/DCMI_D9)  [also labelled SDIO_SCK]
PD2: J1.37 U1.144(PD2/TIM3_ETR/U5_RX/SDMMC1_CMD/DCMI_D11)  [also labelled SDIO_CMD]
PE2: J1.20 U1.1(PE2/SPI4_SCK/SAI1_MCLK_A/QSPI_BK1_IO2/ETH_MII_TXD3/FMC_A23)  [also labelled SAI1_MCLKA]
PE3: J1.19 U1.2(PE3/SAI1_SD_B/FMC_A19)  [also labelled SAI1_SDB]
PE4: J1.18 U1.3(PE4/DFSDM_D3/SPI4_NSS/SAI1_FS_A/FMC_A20/DCMI_D4/LCD_B0)  [also labelled SAI1_FSA]
PE5: J1.17 U1.4(PE5/DFSDM_CKIN3/TIM9_CH1/SPI4_MISO/SAI1_SCK_A/FMC_A21/DCMI_D6/LCD_G0)  [also labelled SAI1_SCKA]
PE6: J1.16 U1.5(PE6/TIM1_BKIN2/TIM9_CH2/SPI4_MOSI/SAI1_SD_A/SAI2_MCK_B/FMC_A22/DCMI_D7/LCD_G1)  [also labelled SAI1_SDA]
PF6: J1.14 U1.24(PF6/TIM10_CH1/SPI5_NSS/SAI1_SD_B/U7_RX/QSPI_BK1_IO3/ADC3_IN4)  [also labelled QSPI_BK1_IO3]
PF7: J1.13 U1.25(PF7/TIM11_CH1/SPI5_SCK/SAI1_MCLK_B/U7_TX/QSPI_BK1_IO2/ADC3_IN5)  [also labelled QSPI_BK1_IO2]
PF8: J1.12 U1.26(PF8/TIM13_CH1/SPI5_MISO/SAI1_SCK_B/U7_RTS/QSPI_BK1_IO0/ADC3_IN6)  [also labelled QSPI_BK1_IO0]
PF9: J1.11 U1.27(PF9/TIM14_CH1/SPI5_MOSI/SAI1_FS_B/U7_CTS/QSPI_BK1_IO1/ADC3_IN7)  [also labelled QSPI_BK1_IO1]
PG3: J2.13 U1.107(PG3/FMC_A13)  [also labelled T_MISO]
PG13: J1.33 U1.156(PG13/LPTIM1_OUT/SPI6_SCK/U6_CTS/ETH_MII_TXD0/ETH_RMII_TXD0/FMC_A24/LCD_R0)  [also labelled RMII_TXD0]
PG14: J1.32 U1.157(PG14/LPTIM1_ETR/SPI6_MOSI/U6_TX/QSPI_BK2_IO3/ETH_MII_TXD1/ETH_RMII_TXD1/FMC_A25/LCD_B0)  [also labelled RMII_TXD1]
PH6: J2.8 U1.83(PH6/I2C2_SMBA/SPI5_SCK/TIM12_CH1/ETH_MII_RXD2/FMC_SDNE1/DCMI_D8)  [also labelled T_SCK]
PH7: J2.9 U1.84(PH7/I2C3_SCL/SPI5_MISO/ETH_MII_RXD3/FMC_SDCKE1/DCMI_D9)  [also labelled T_PEN]
PI3: J2.41 U1.134(PI3/TIM8_ETR/SPI2_MOSI/I2S2_SD/FMC_D27/DCMI_D10)  [also labelled T_MOSI]
PI8: J2.40 U1.7(PI8/RTC_TAMP2/RTC_TS/WKUP5)  [also labelled T_CS]
RESET: C12.1 J1.10 P1.5 R6.1 RST.1 U1.31(NRST)
VBAT: D1.2 J1.29
VCC5: J1.58 J1.59 J1.60
VREF+: J1.2
NetC1_1: C1.1 D1.3 U1.6(VBAT)
NetC2_2: C2.2 C4.2 R2.1 U1.38(VREF+)
NetC3_1: C3.1 U1.81(VCAP_1)
NetC5_1: C5.1 U1.125(VCAP_2)
NetC8_2: C8.2 U1.9(PC14/OSC32_IN) Y1.1(OSC1)
NetC9_2: C9.2 U1.10(PC15/OSC32_OUT) Y1.2(OSC2)
NetC10_2: C10.2 U1.30(PH1/OSC_OUT) Y2.1(HOT)
NetC11_2: C11.2 U1.29(PH0/OSC_IN) Y2.3(HOT)
NetR1_1: R1.1 U1.48(BYPASS_REG)
NetR4_1: R4.1 R5.1 U1.171(PDR_ON)

### Library data of the parts
C1-C27 = C
D1 = BAT54C: 双肖特基二极管
J1 J2 = 3710F: 3710F060046G3FT01
P1 = Header 5: Header, 5-Pin; LatestRevisionDate: 17-Jul-2002; LatestRevisionNote: Re-released for DXP Platform.; Publisher: Altium Limited
R1-R9 = R
Y1 = XTAL: 普通晶振; Published: 8-Jun-2000; LatestRevisionDate: 17-Jul-2002; LatestRevisionNote: Re-released for DXP Platform.; Publisher: Altium Limited
Y2 = XTAL_3225: 3225贴片无源晶振

## Nets that join several sheets
GND: mem (26 pins), stm (49 pins)
VCC3.3: mem (21 pins), stm (P1.4 R6.2 R8.1 R9.1)
FMC_A0: mem (U3.23), stm (U1.16)
FMC_A1: mem (U3.24), stm (U1.17)
FMC_A2: mem (U3.25), stm (U1.18)
FMC_A3: mem (U3.26), stm (U1.19)
FMC_A4: mem (U3.29), stm (U1.20)
FMC_A5: mem (U3.30), stm (U1.21)
FMC_A6: mem (U3.31), stm (U1.60)
FMC_A7: mem (U3.32), stm (U1.63)
FMC_A8: mem (U3.33), stm (U1.64)
FMC_A9: mem (U3.34), stm (U1.65)
FMC_A10: mem (U3.22), stm (U1.66)
FMC_A11: mem (U3.35), stm (U1.67)
FMC_A12: mem (U3.36), stm (U1.106)
FMC_A16_CLE: mem (U4.16), stm (J2.23 U1.99)
FMC_A17_ALE: mem (U4.17), stm (J2.21 U1.100)
FMC_BA0: mem (U3.20), stm (U1.108)
FMC_BA1: mem (U3.21), stm (U1.109)
FMC_D0: mem (U3.2 U4.29), stm (J2.45 U1.104)
FMC_D1: mem (U3.4 U4.30), stm (J2.46 U1.105)
FMC_D2: mem (U3.5 U4.31), stm (J2.47 U1.142)
FMC_D3: mem (U3.7 U4.32), stm (J2.48 U1.143)
FMC_D4: mem (U3.8 U4.41), stm (J2.49 U1.68)
FMC_D5: mem (U3.10 U4.42), stm (J2.50 U1.69)
FMC_D6: mem (U3.11 U4.43), stm (J2.51 U1.70)
FMC_D7: mem (U3.13 U4.44), stm (J2.52 U1.73)
FMC_D8: mem (U3.42), stm (J2.53 U1.74)
FMC_D9: mem (U3.44), stm (J2.54 U1.75)
FMC_D10: mem (U3.45), stm (J2.55 U1.76)
FMC_D11: mem (U3.47), stm (J2.56 U1.77)
FMC_D12: mem (U3.48), stm (J2.57 U1.78)
FMC_D13: mem (U3.50), stm (J2.58 U1.96)
FMC_D14: mem (U3.51), stm (J2.59 U1.97)
FMC_D15: mem (U3.53), stm (J2.60 U1.98)
FMC_NBL0: mem (U3.15), stm (J2.43 U1.169)
FMC_NBL1: mem (U3.39), stm (J2.44 U1.170)
FMC_NCE3: mem (R17.2 U4.9), stm (U1.152)
FMC_NOE: mem (U4.8), stm (J2.26 U1.146)
FMC_NWAIT: mem (U4.7), stm (J2.27 U1.150)
FMC_NWE: mem (U4.18), stm (J2.22 U1.147)
FMC_SDCKE0: mem (U3.37), stm (U1.35)
FMC_SDCLK: mem (U3.38), stm (U1.112)
FMC_SDNCAS: mem (U3.17), stm (U1.160)
FMC_SDNE0: mem (R19.2 U3.19), stm (U1.34)
FMC_SDNRAS: mem (U3.18), stm (U1.59)
FMC_SDNWE: mem (U3.16), stm (U1.32)
IIC_SCL: mem (R20.1 U5.6), stm (J1.8 U1.45)
IIC_SDA: mem (R21.1 U5.5), stm (J1.7 U1.46)
PB2: mem (U6.6), stm (J1.55 U1.58)
PB6: mem (U6.1), stm (J1.24 U1.164)
PF6: mem (U6.7), stm (J1.14 U1.24)
PF7: mem (U6.3), stm (J1.13 U1.25)
PF8: mem (U6.5), stm (J1.12 U1.26)
PF9: mem (U6.2), stm (J1.11 U1.27)